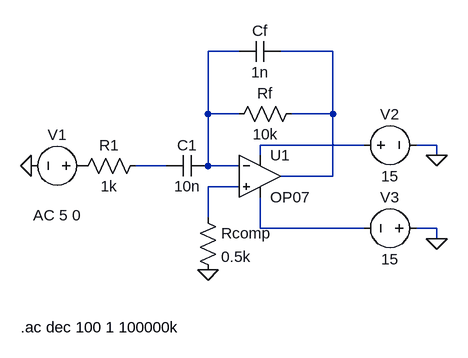
[diagram p0: schematic PID differentiator.asc]
PID differentiator.asc, the LTspice schematic file:
Version 4.1
SHEET 1 880 680
WIRE 256 -16 208 -16
WIRE 400 -16 320 -16
WIRE 208 80 208 -16
WIRE 256 80 208 80
WIRE 400 80 400 -16
WIRE 400 80 336 80
WIRE 448 128 288 128
WIRE 560 128 528 128
WIRE 288 144 288 128
WIRE 560 144 560 128
WIRE 144 160 96 160
WIRE 208 160 208 80
WIRE 256 160 208 160
WIRE 400 176 400 80
WIRE 400 176 320 176
WIRE 256 192 208 192
WIRE 208 240 208 192
WIRE 288 256 288 208
WIRE 448 256 288 256
WIRE 560 256 528 256
WIRE 560 272 560 256
FLAG -64 160 0
FLAG 208 320 0
FLAG 560 144 0
FLAG 560 272 0
SYMBOL OpAmps\\OP07 288 112 R0
SYMATTR InstName U1
SYMBOL res 352 64 R90
WINDOW 0 0 56 VBottom 2
WINDOW 3 32 56 VTop 2
SYMATTR InstName Rf
SYMATTR Value 10k
SYMBOL res 112 144 R90
WINDOW 0 0 56 VBottom 2
WINDOW 3 32 56 VTop 2
SYMATTR InstName R1
SYMATTR Value 1k
SYMBOL cap 320 -32 R90
WINDOW 0 0 32 VBottom 2
WINDOW 3 32 32 VTop 2
SYMATTR InstName Cf
SYMATTR Value 1n
SYMBOL cap 208 144 R90
WINDOW 0 0 32 VBottom 2
WINDOW 3 32 32 VTop 2
SYMATTR InstName C1
SYMATTR Value 10n
SYMBOL res 192 224 R0
SYMATTR InstName Rcomp
SYMATTR Value 0.5k
SYMBOL voltage 32 160 R90
WINDOW 0 -32 56 VBottom 2
WINDOW 3 32 56 VTop 2
WINDOW 123 60 56 VTop 2
WINDOW 39 0 0 Left 0
SYMATTR InstName V1
SYMATTR Value ""
SYMATTR Value2 AC 5 0
SYMBOL voltage 432 128 R270
WINDOW 0 32 56 VTop 2
WINDOW 3 -32 56 VBottom 2
WINDOW 123 0 0 Left 0
WINDOW 39 0 0 Left 0
SYMATTR InstName V2
SYMATTR Value 15
SYMBOL voltage 544 256 R90
WINDOW 0 -32 56 VBottom 2
WINDOW 3 32 56 VTop 2
WINDOW 123 0 0 Left 0
WINDOW 39 0 0 Left 0
SYMATTR InstName V3
SYMATTR Value 15
TEXT -80 408 Left 2 !.ac dec 100 1 100000k

The netlist it stands for:
* PID differentiator.asc
X§U1 N005 N001 N003 N006 N002 LT1001  ; OP07, pins In+ In- V+ V- OUT
Rf N002 N001 10k
R1 N004 P001 1k
Cf N002 N001 1n
C1 N001 N004 10n
Rcomp N005 0 0.5k
V1 P001 0 AC 5 0
V2 N003 0 15
V3 0 N006 15
.ac dec 100 1 100000k
.lib LTC.lib
.backanno
.end